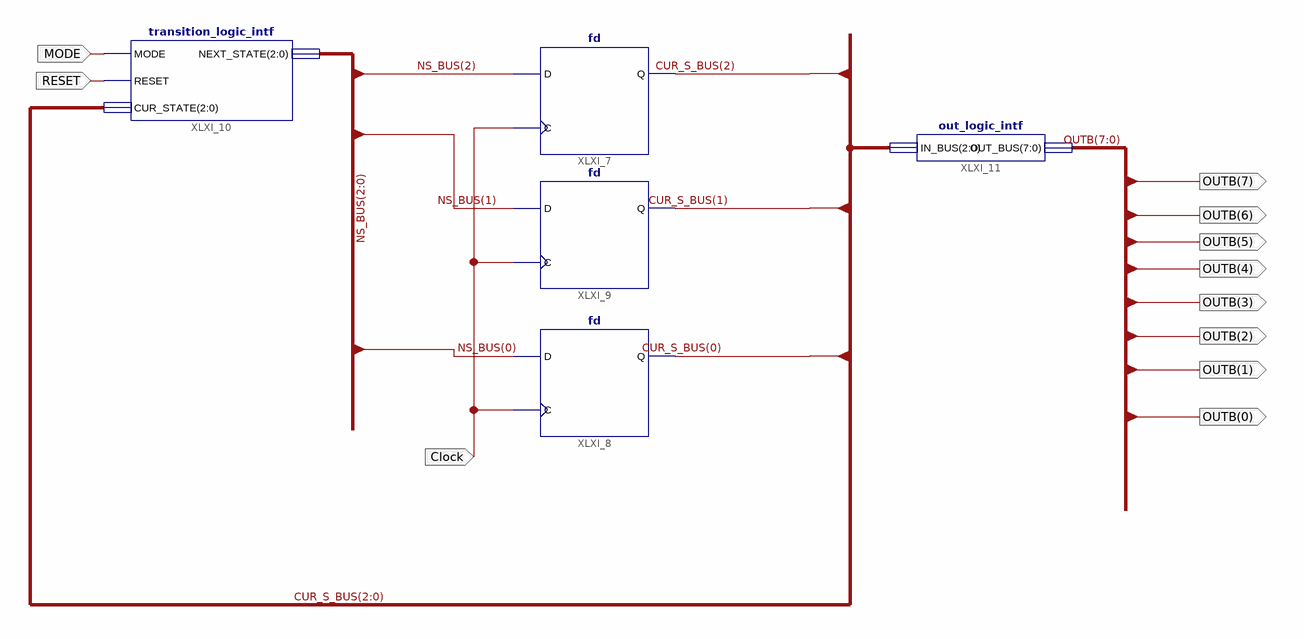
[diagram p0: schematic sheet 1]
// Xilinx ISE schematic Schema.sch (spartan3a) as structural Verilog: 5 symbols, 11 ports
module Schema (
  input  MODE,
  input  RESET,
  input  Clock,
  output [7:0] OUTB
);

  wire [2:0] CUR_S_BUS, NS_BUS;

  fd XLXI_7 (.C(Clock), .D(NS_BUS[2]), .Q(CUR_S_BUS[2]));
  fd XLXI_8 (.C(Clock), .D(NS_BUS[0]), .Q(CUR_S_BUS[0]));
  fd XLXI_9 (.C(Clock), .D(NS_BUS[1]), .Q(CUR_S_BUS[1]));
  transition_logic_intf XLXI_10 (.MODE(MODE), .RESET(RESET), .CUR_STATE(CUR_S_BUS), .NEXT_STATE(NS_BUS));
  out_logic_intf XLXI_11 (.IN_BUS(CUR_S_BUS), .OUT_BUS(OUTB));
endmodule
